# Altium schematic sheet Horloge_Display.SchDoc
size A4
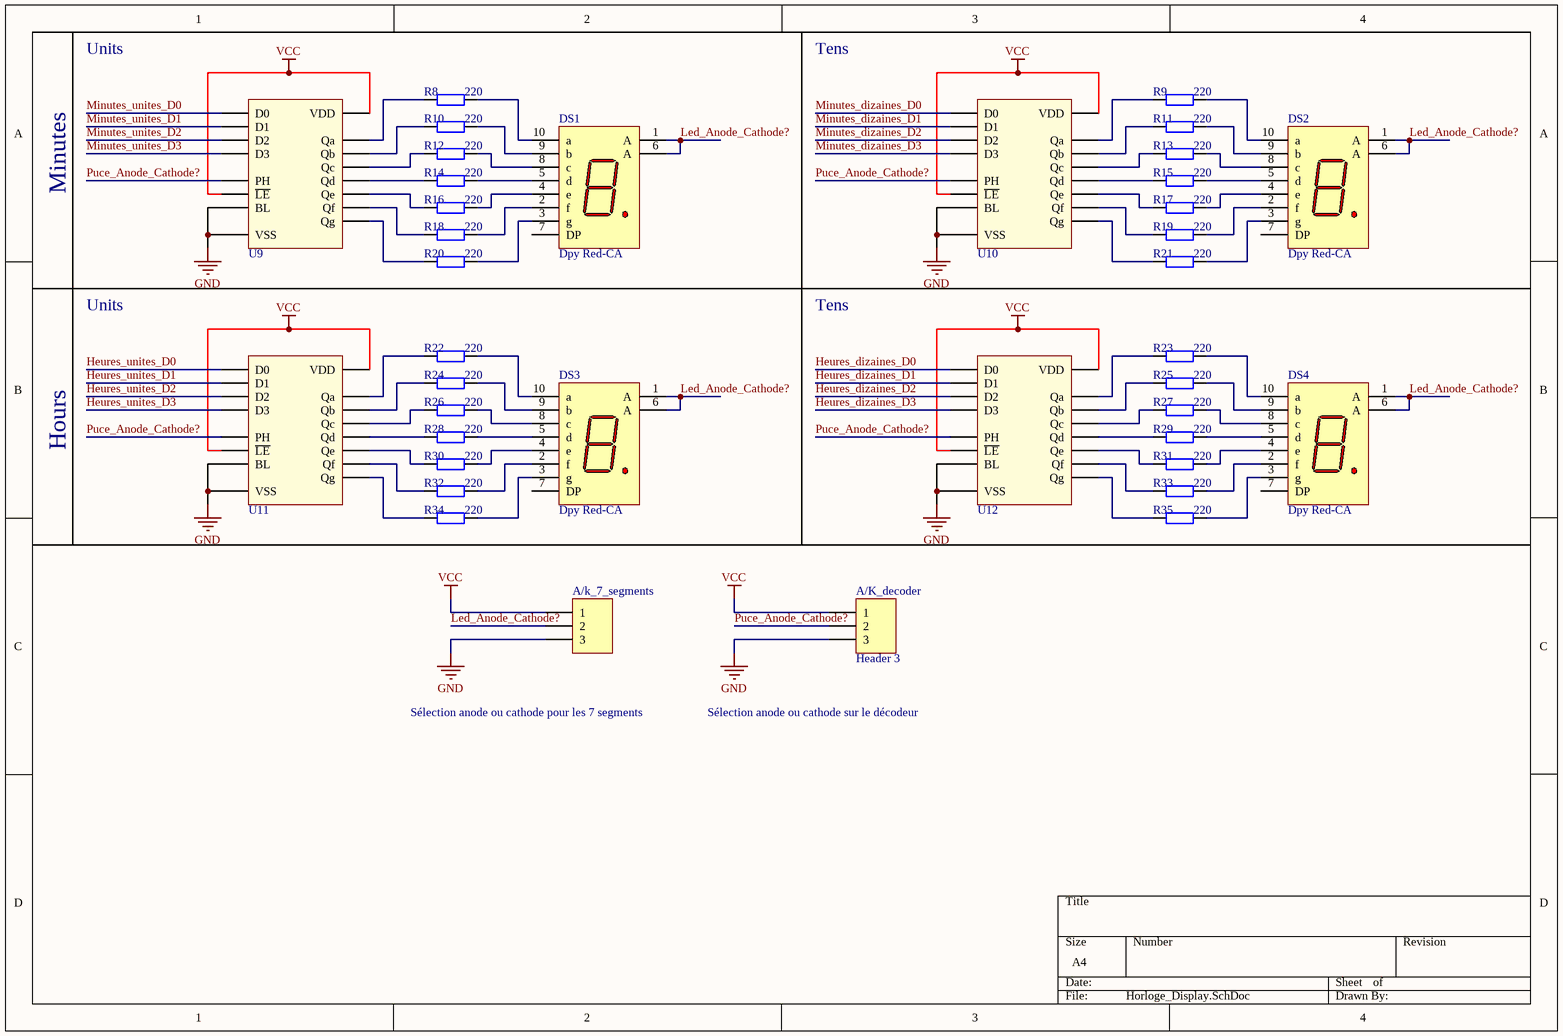
[diagram p0: Horloge_Display.SchDoc]

## Parts
A/k_7_segments  Common_7-segments  [HDR1X3]  (value not drawn)
A/K_decoder  Header 3  [HDR1X3]
DS1  Dpy Red-CA  [7 segments 5082-7731]
DS2  Dpy Red-CA  [7 segments 5082-7731]
DS3  Dpy Red-CA  [7 segments 5082-7731]
DS4  Dpy Red-CA  [7 segments 5082-7731]
R8  value 220  [Resistor 1206]  (hidden comment: Res2)
R9  value 220  [Resistor 1206]  (hidden comment: Res2)
R10  value 220  [Resistor 1206]  (hidden comment: Res2)
R11  value 220  [Resistor 1206]  (hidden comment: Res2)
R12  value 220  [Resistor 1206]  (hidden comment: Res2)
R13  value 220  [Resistor 1206]  (hidden comment: Res2)
R14  value 220  [Resistor 1206]  (hidden comment: Res2)
R15  value 220  [Resistor 1206]  (hidden comment: Res2)
R16  value 220  [Resistor 1206]  (hidden comment: Res2)
R17  value 220  [Resistor 1206]  (hidden comment: Res2)
R18  value 220  [Resistor 1206]  (hidden comment: Res2)
R19  value 220  [Resistor 1206]  (hidden comment: Res2)
R20  value 220  [Resistor 1206]  (hidden comment: Res2)
R21  value 220  [Resistor 1206]  (hidden comment: Res2)
R22  value 220  [Resistor 1206]  (hidden comment: Res2)
R23  value 220  [Resistor 1206]  (hidden comment: Res2)
R24  value 220  [Resistor 1206]  (hidden comment: Res2)
R25  value 220  [Resistor 1206]  (hidden comment: Res2)
R26  value 220  [Resistor 1206]  (hidden comment: Res2)
R27  value 220  [Resistor 1206]  (hidden comment: Res2)
R28  value 220  [Resistor 1206]  (hidden comment: Res2)
R29  value 220  [Resistor 1206]  (hidden comment: Res2)
R30  value 220  [Resistor 1206]  (hidden comment: Res2)
R31  value 220  [Resistor 1206]  (hidden comment: Res2)
R32  value 220  [Resistor 1206]  (hidden comment: Res2)
R33  value 220  [Resistor 1206]  (hidden comment: Res2)
R34  value 220  [Resistor 1206]  (hidden comment: Res2)
R35  value 220  [Resistor 1206]  (hidden comment: Res2)
U9  7 segment driver  [HEF4543]  (value not drawn)
U10  7 segment driver  [HEF4543]  (value not drawn)
U11  7 segment driver  [HEF4543]  (value not drawn)
U12  7 segment driver  [HEF4543]  (value not drawn)

## Nets
GND: A/k_7_segments.3 A/K_decoder.3 U9.7(BL) U9.8(VSS) U10.7(BL) U10.8(VSS) U11.7(BL) U11.8(VSS) U12.7(BL) U12.8(VSS)
VCC: A/k_7_segments.1 A/K_decoder.1 U9.1(~{LE}) U9.16(VDD) U10.1(~{LE}) U10.16(VDD) U11.1(~{LE}) U11.16(VDD) U12.1(~{LE}) U12.16(VDD)
Heures_dizaines_D0: U12.5(D0)
Heures_dizaines_D1: U12.3(D1)
Heures_dizaines_D2: U12.2(D2)
Heures_dizaines_D3: U12.4(D3)
Heures_unites_D0: U11.5(D0)
Heures_unites_D1: U11.3(D1)
Heures_unites_D2: U11.2(D2)
Heures_unites_D3: U11.4(D3)
Led_Anode_Cathode?: A/k_7_segments.2 DS1.1(A) DS1.6(A) DS2.1(A) DS2.6(A) DS3.1(A) DS3.6(A) DS4.1(A) DS4.6(A)
Minutes_dizaines_D0: U10.5(D0)
Minutes_dizaines_D1: U10.3(D1)
Minutes_dizaines_D2: U10.2(D2)
Minutes_dizaines_D3: U10.4(D3)
Minutes_unites_D0: U9.5(D0)
Minutes_unites_D1: U9.3(D1)
Minutes_unites_D2: U9.2(D2)
Minutes_unites_D3: U9.4(D3)
Puce_Anode_Cathode?: A/K_decoder.2 U9.6(PH) U10.6(PH) U11.6(PH) U12.6(PH)
NetDS1_2: DS1.2(f) R18.2
NetDS1_3: DS1.3(g) R20.2
NetDS1_4: DS1.4(e) R16.2
NetDS1_5: DS1.5(d) R14.2
NetDS1_8: DS1.8(c) R12.2
NetDS1_9: DS1.9(b) R10.2
NetDS1_10: DS1.10(a) R8.2
NetDS2_2: DS2.2(f) R19.2
NetDS2_3: DS2.3(g) R21.2
NetDS2_4: DS2.4(e) R17.2
NetDS2_5: DS2.5(d) R15.2
NetDS2_8: DS2.8(c) R13.2
NetDS2_9: DS2.9(b) R11.2
NetDS2_10: DS2.10(a) R9.2
NetDS3_2: DS3.2(f) R32.2
NetDS3_3: DS3.3(g) R34.2
NetDS3_4: DS3.4(e) R30.2
NetDS3_5: DS3.5(d) R28.2
NetDS3_8: DS3.8(c) R26.2
NetDS3_9: DS3.9(b) R24.2
NetDS3_10: DS3.10(a) R22.2
NetDS4_2: DS4.2(f) R33.2
NetDS4_3: DS4.3(g) R35.2
NetDS4_4: DS4.4(e) R31.2
NetDS4_5: DS4.5(d) R29.2
NetDS4_8: DS4.8(c) R27.2
NetDS4_9: DS4.9(b) R25.2
NetDS4_10: DS4.10(a) R23.2
NetR8_1: R8.1 U9.9(Qa)
NetR9_1: R9.1 U10.9(Qa)
NetR10_1: R10.1 U9.10(Qb)
NetR11_1: R11.1 U10.10(Qb)
NetR12_1: R12.1 U9.11(Qc)
NetR13_1: R13.1 U10.11(Qc)
NetR14_1: R14.1 U9.12(Qd)
NetR15_1: R15.1 U10.12(Qd)
NetR16_1: R16.1 U9.13(Qe)
NetR17_1: R17.1 U10.13(Qe)
NetR18_1: R18.1 U9.15(Qf)
NetR19_1: R19.1 U10.15(Qf)
NetR20_1: R20.1 U9.14(Qg)
NetR21_1: R21.1 U10.14(Qg)
NetR22_1: R22.1 U11.9(Qa)
NetR23_1: R23.1 U12.9(Qa)
NetR24_1: R24.1 U11.10(Qb)
NetR25_1: R25.1 U12.10(Qb)
NetR26_1: R26.1 U11.11(Qc)
NetR27_1: R27.1 U12.11(Qc)
NetR28_1: R28.1 U11.12(Qd)
NetR29_1: R29.1 U12.12(Qd)
NetR30_1: R30.1 U11.13(Qe)
NetR31_1: R31.1 U12.13(Qe)
NetR32_1: R32.1 U11.15(Qf)
NetR33_1: R33.1 U12.15(Qf)
NetR34_1: R34.1 U11.14(Qg)
NetR35_1: R35.1 U12.14(Qg)

Not connected (* = marked no-connect by the designer): DS1 7(DP); DS2 7(DP); DS3 7(DP); DS4 7(DP)

## Notes on the sheet
- Units
- Tens
- Minutes
- Hours
- Sélection anode ou cathode pour les 7 segments
- Sélection anode ou cathode sur le décodeur

## Library data of the parts
A/k_7_segments A/K_decoder = Header 3: Header, 3-Pin; LatestRevisionDate: 17-Jul-2002; LatestRevisionNote: Re-released for DXP Platform.; Publisher: Altium Limited
DS1-DS4 = Dpy Red-CA: 7.62 mm Black Surface HER 7-Segment Display: CA, RH DP; MinimumIntensity: 360 ucd; Note: IF = 5 mA; Colour: High Efficiency Red (HER); Note: Pins 1 and 6 are redundant Anodes.; Published: 8-Jun-2000; LatestRevisionDate: 17-Dec-2003; LatestRevisionNote: Schematic revised, PCB Footprint replaced.; DatasheetVersion: 19-Feb-2002; PackageVersion: 11-Feb-2002; PackageReference: A; Publisher: Altium Limited; PackageDescription: LED, 7-Segment Display, 7.62 mm, RHD; 10 Leads; Row Space 5.08 mm; Pitch 2.54 mm; ComponentLink1Description: Manufacturer Link; ComponentLink1URL: http://www.agilent.com/
R8-R35 = Res2: Resistor; Published: 8-Jun-2000; LatestRevisionDate: 17-Jul-2002; LatestRevisionNote: Re-released for DXP Platform.; PackageReference: AXIAL-0.4; Publisher: Altium Limited; PackageDescription: Axial Device, Thru-Hole; 2 Leads; 0.4 in Pin Spacing
U9-U12 = HEF4543B